# EAGLE design Proj15 (EAGLE 9.6.0)
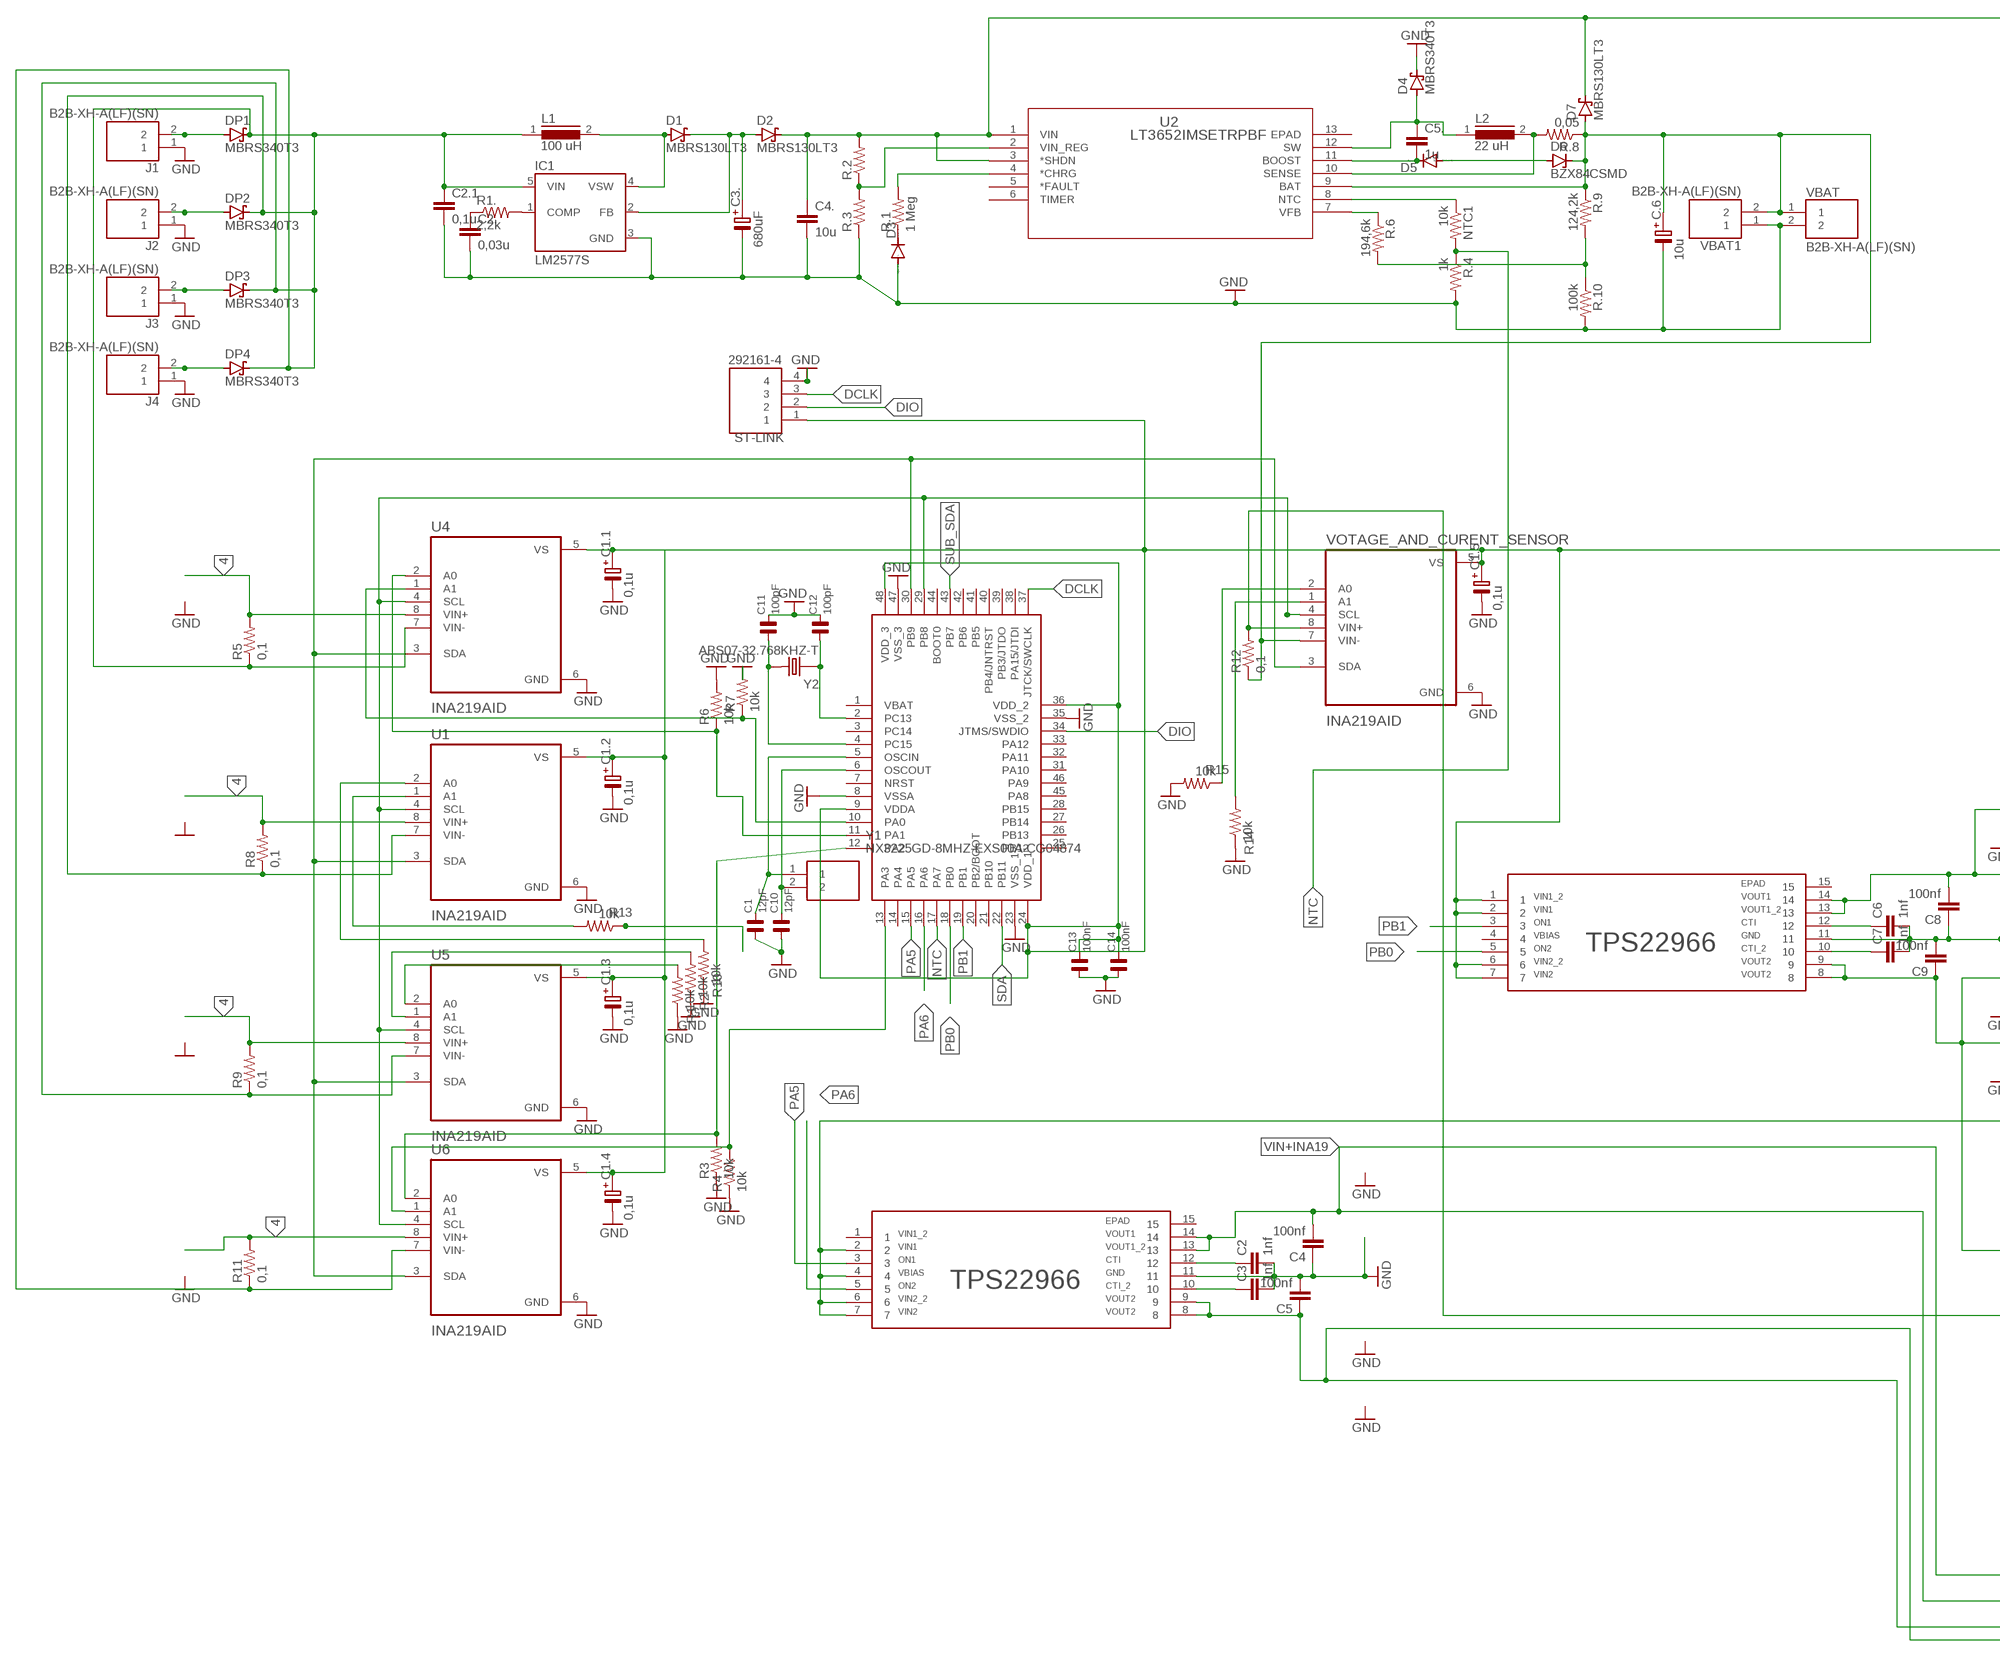
[diagram p0: schematic, sheet 1, part 1 of 2]
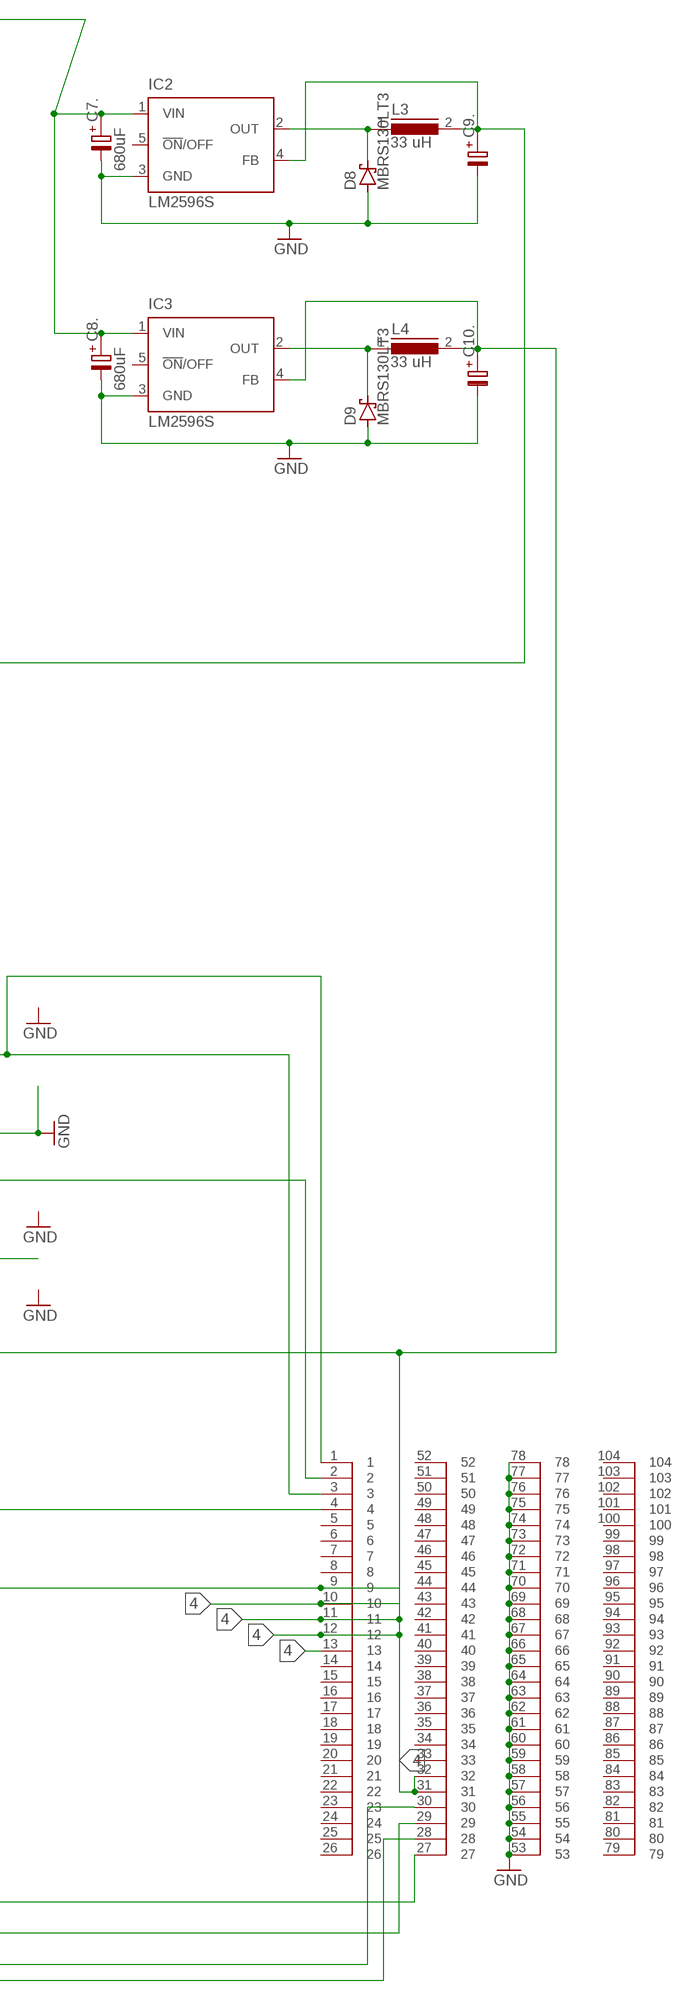
[diagram p1: schematic, sheet 1, part 2 of 2]

## Parts
C1  12pF  C0805  [0805]
C1.1  0,1u  C-PR-SMD-TE-D  [TE-D-7343]
C1.2  0,1u  C-PR-SMD-TE-D  [TE-D-7343]
C1.3  0,1u  C-PR-SMD-TE-D  [TE-D-7343]
C1.4  0,1u  C-PR-SMD-TE-D  [TE-D-7343]
C1.5  0,1u  C-PR-SMD-TE-D  [TE-D-7343]
C2  1nf  C-EUC0805  [C0805]
C2.  0,03u  C-EUC1206  [C1206]
C2.1  0,1u  C-EUC1206  [C1206]
C3  1nf  C-EUC0805  [C0805]
C3.  680uF  C-PR-SMD-TE-D  [TE-D-7343]
C4  100nf  C-EUC0805  [C0805]
C4.  10u  C-EUC1206  [C1206]
C5  100nf  C-EUC0805  [C0805]
C5.  1u  C-EUC1206  [C1206]
C6  1nf  C-EUC0805  [C0805]
C7  1nf  C-EUC0805  [C0805]
C7.  680uF  C-PR-SMD-TE-D  [TE-D-7343]
C8  100nf  C-EUC0805  [C0805]
C8.  680uF  C-PR-SMD-TE-D  [TE-D-7343]
C9  100nf  C-EUC0805  [C0805]
C9.  C-PR-SMD-TE-D  [TE-D-7343]
C10  12pF  C0805  [0805]
C10.  C-PR-SMD-TE-D  [TE-D-7343]
C11  100pF  C0805  [0805]
C12  100pF  C0805  [0805]
C13  100nF  C0805  [0805]
C14  100nF  C0805  [0805]
C.6  10u  C-PR-SMD-TE-D  [TE-D-7343]
D1  MBRS130LT3  [SMB]
D2  MBRS130LT3  [SMB]
D3  DIODE-DO214BA  [DO214BA]
D4  MBRS340T3  [SMC]
D5  DIODE-DO214BA  [DO214BA]
D6  BZX84CSMD  [TO236]
D7  MBRS130LT3  [SMB]
D8  MBRS130LT3  [SMB]
D9  MBRS130LT3  [SMB]
DP1  MBRS340T3  [SMC]
DP2  MBRS340T3  [SMC]
DP3  MBRS340T3  [SMC]
DP4  MBRS340T3  [SMC]
IC1  LM2577S  [TO263-5]
IC2  LM2596S  [TO263-5]
IC3  LM2596S  [TO263-5]
J1  B2B-XH-A(LF)(SN)  [JST_B2B-XH-A(LF)(SN)]
J2  B2B-XH-A(LF)(SN)  [JST_B2B-XH-A(LF)(SN)]
J3  B2B-XH-A(LF)(SN)  [JST_B2B-XH-A(LF)(SN)]
J4  B2B-XH-A(LF)(SN)  [JST_B2B-XH-A(LF)(SN)]
L1  100 uH  DR127  [DR127]
L2  22 uH  DR127  [DR127]
L3  33 uH  DR127  [DR127]
L4  33 uH  DR127  [DR127]
NTC1  10k  R-US_R0603  [R0603]
R1  10k  R-US_R3216  [R3216]
R1.  2,2k  R-US_R3216  [R3216]
R2  10k  R-US_R3216  [R3216]
R3  10k  R-US_R3216  [R3216]
R4  10k  R-US_R3216  [R3216]
R5  0,1  R-US_R3216  [R3216]
R6  10k  R-US_R3216  [R3216]
R7  10k  R-US_R3216  [R3216]
R8  0,1  R-US_R3216  [R3216]
R9  0,1  R-US_R3216  [R3216]
R10  10k  R-US_R3216  [R3216]
R11  0,1  R-US_R3216  [R3216]
R12  0,1  R-US_R3216  [R3216]
R13  10k  R-US_R3216  [R3216]
R14  10k  R-US_R3216  [R3216]
R15  10k  R-US_R3216  [R3216]
R.1  1 Meg  R-US_R3216  [R3216]
R.2  R-US_R3216  [R3216]
R.3  R-US_R3216  [R3216]
R.4  1k  R-US_R3216  [R3216]
R.6  194,6k  R-US_R3216  [R3216]
R.8  0,05  R-US_R3216  [R3216]
R.9  124,2k  R-US_R3216  [R3216]
R.10  100k  R-US_R3216  [R3216]
ST-LINK  292161-4  [TE_292161-4]
U1  INA219AID  [SOIC127P599X175-8N]
U2  LT3652IMSETRPBF  [MSOP-12_MSE]
U3  QFP50P900X900X160-48N  [QFP50P900X900X160-48N]
U4  INA219AID  [SOIC127P599X175-8N]
U5  INA219AID  [SOIC127P599X175-8N]
U6  INA219AID  [SOIC127P599X175-8N]
U$1  TPS22966  [SON40P300X200X80-15N]
U$2  TPS22966  [SON40P300X200X80-15N]
U$3  HEADERPIN4X26  [HEADERPIN4X26]
VBAT  B2B-XH-A(LF)(SN)  [JST_B2B-XH-A(LF)(SN)]
VBAT1  B2B-XH-A(LF)(SN)  [JST_B2B-XH-A(LF)(SN)]
VOTAGE_AND_CURENT_SENSOR  INA219AID  [SOIC127P599X175-8N]
Y1  NX3225GD-8MHZ-EXS00A-CG04874  [NX3225GD-STD-CRA-3]
Y2  ABS07-32.768KHZ-T  [XTAL_ABS07-32.768KHZ-T]

## Nets
4: C10..+ IC3.4(FB) L4.2 R5.2 R8.2 R9.2 R11.2 R12.2 U1.8(VIN+) U4.8(VIN+) U5.8(VIN+) U6.8(VIN+) U$1.2 U$1.4 U$1.6 U$1.7 U$3.9 U$3.10 U$3.11 U$3.12 U$3.13 U$3.31 U$3.32 VOTAGE_AND_CURENT_SENSOR.8(VIN+)
DCLK: ST-LINK.3 U3.37(JTCK/SWCLK)
DIO: ST-LINK.2 U3.34(JTMS/SWDIO)
GND: C1.1 C1.1.- C1.2.- C1.3.- C1.4.- C1.5.- C2.1.2 C2.2 C2..2 C3.2 C3..- C4.1 C4..2 C5.2 C6.2 C7.2 C7..- C8.1 C8..- C9.2 C9..- C10.1 C10..- C11.2 C12.2 C13.1 C14.1 C.6.- D3.A D4.C D8.A D9.A IC1.3(GND) IC2.3(GND) IC3.3(GND) J1.1 J2.1 J3.1 J4.1 R1.1 R2.1 R3.1 R4.1 R6.2 R7.2 R10.1 R14.1 R15.2 R.3.1 R.4.2 R.10.2 ST-LINK.4 U1.6(GND) U3.8(VSSA) U3.23(VSS_1) U3.35(VSS_2) U3.47(VSS_3) U4.6(GND) U5.6(GND) U6.6(GND) U$1.11 U$2.11 U$3.53 U$3.54 U$3.55 U$3.56 U$3.57 U$3.58 U$3.59 U$3.60 U$3.61 U$3.62 U$3.63 U$3.64 U$3.65 U$3.66 U$3.67 U$3.68 U$3.69 U$3.70 U$3.71 U$3.72 U$3.73 U$3.74 U$3.75 U$3.76 U$3.77 U$3.78 VBAT1.1 VBAT.2 VOTAGE_AND_CURENT_SENSOR.6(GND)
N$1: R10.2 U1.2(A0)
N$2: U1.4(SCL) U3.29(PB8) U4.4(SCL) U5.4(SCL) U6.4(SCL) VOTAGE_AND_CURENT_SENSOR.4(SCL)
N$3: R1.2 U5.2(A0)
N$4: R2.2 U5.1(A1)
N$7: R3.2 U3.12(PA2) U6.2(A0)
N$8: R4.2 U3.13(PA3) U6.1(A1)
N$11: R6.1 U3.11(PA1) U4.2(A0)
N$12: R7.1 U3.10(PA0) U4.1(A1)
N$14: C8.2 U$2.13 U$2.14 U$3.1 U$3.3
N$16: U1.3(SDA) U3.30(PB9) U4.3(SDA) U5.3(SDA) U6.3(SDA) VOTAGE_AND_CURENT_SENSOR.3(SDA)
N$18: R15.1 VOTAGE_AND_CURENT_SENSOR.2(A0)
N$20: C12.1 U3.2(PC13) Y2.1
N$21: C2.1 U$1.12
N$22: C3.1 U$1.10
N$23: C5.1 U$1.8 U$1.9 U$3.28 U$3.30
N$24: C10.2 U3.6(OSCOUT) Y1.2
N$25: C6.1 U$2.12
N$26: C7.1 U$2.10
N$27: C1.2 U3.5(OSCIN) Y1.1
N$28: C9.1 U$2.8 U$2.9 U$3.2 U$3.4
N$29: C11.1 U3.4(PC15) Y2.2
N$30: D8.C IC2.2(OUT) L3.1
N$31: DP2.A J2.2
N$32: DP3.A J3.2
N$33: DP4.A J4.2
N$34: DP1.A J1.2
N$36: D1.A IC1.4(VSW) L1.2
N$37: C3..+ D1.C D2.A IC1.2(FB)
N$38: IC1.1(COMP) R1..2
N$39: R13.2 U1.1(A1)
N$40: C2..1 R1..1
N$41: C4..1 C7..+ C8..+ D2.C D7.C IC2.1(VIN) IC3.1(VIN) R.2.2 U2.1(VIN) U2.3(*SHDN)
N$42: R.2.1 R.3.2 U2.2(VIN_REG)
N$43: D3.C R.1.1
N$44: R.1.2 U2.4(*CHRG)
N$45: R13.1
N$46: C5..2 D5.C U2.11(BOOST)
N$47: C5..1 D4.A L2.1 U2.12(SW)
N$48: L2.2 R.8.2 U2.10(SENSE)
N$49: R.6.1 U2.7(VFB)
N$50: D5.A D6.A
N$51: C.6.+ D6.C D7.A R12.1 R.8.1 R.9.1 U2.9(BAT) VBAT1.2 VBAT.1 VOTAGE_AND_CURENT_SENSOR.7(VIN-)
N$52: NTC1.1 U2.8(NTC)
N$54: R.6.2 R.9.2 R.10.1
N$55: C1.1.+ C1.2.+ C1.3.+ C1.4.+ C1.5.+ C9..+ C13.2 C14.2 IC2.4(FB) L3.2 ST-LINK.1 U1.5(VS) U3.9(VDDA) U3.24(VDD_1) U3.36(VDD_2) U3.48(VDD_3) U4.5(VS) U5.5(VS) U6.5(VS) U$2.1 U$2.2 U$2.6 U$2.7 VOTAGE_AND_CURENT_SENSOR.5(VS)
N$56: D9.C IC3.2(OUT) L4.1
N$58: C2.1.1 DP1.C DP2.C DP3.C DP4.C IC1.5(VIN) L1.1 R5.1 R8.1 R9.1 R11.1 U1.7(VIN-) U4.7(VIN-) U5.7(VIN-) U6.7(VIN-)
NTC: NTC1.2 R14.2 R.4.1 U3.17(PA7) VOTAGE_AND_CURENT_SENSOR.1(A1)
PA5: U3.15(PA5) U$1.3
PA6: U3.16(PA6) U$1.5
PB0: U3.18(PB0) U$2.5
PB1: U3.19(PB1) U$2.3
SDA: U3.22(PB11)
SUB_SDA: U3.43(PB7)
VIN+INA19: C4.2 U$1.13 U$1.14 U$3.27 U$3.29
Unconnected: IC2.5(!ON!/OFF) IC3.5(!ON!/OFF) U2.5(*FAULT) U2.6(TIMER) U2.13(EPAD) U3.1(VBAT) U3.3(PC14) U3.7(NRST) U3.14(PA4) U3.20(PB2/BOOT) U3.21(PB10) U3.25(PB12) U3.26(PB13) U3.27(PB14) U3.28(PB15) U3.31(PA10) U3.32(PA11) U3.33(PA12) U3.38(PA15/JTDI) U3.39(PB3/JTDO) U3.40(PB4/JNTRST) U3.41(PB5) U3.42(PB6) U3.44(BOOT0) U3.45(PA8) U3.46(PA9) U$1.1 U$1.15 U$2.4 U$2.15 U$3.5 U$3.6 U$3.7 U$3.8 U$3.14 U$3.15 U$3.16 U$3.17 U$3.18 U$3.19 U$3.20 U$3.21 U$3.22 U$3.23 U$3.24 U$3.25 U$3.26 U$3.33 U$3.34 U$3.35 U$3.36 U$3.37 U$3.38 U$3.39 U$3.40 U$3.41 U$3.42 U$3.43 U$3.44 U$3.45 U$3.46 U$3.47 U$3.48 U$3.49 U$3.50 U$3.51 U$3.52 U$3.79 U$3.80 U$3.81 U$3.82 U$3.83 U$3.84 U$3.85 U$3.86 U$3.87 U$3.88 U$3.89 U$3.90 U$3.91 U$3.92 U$3.93 U$3.94 U$3.95 U$3.96 U$3.97 U$3.98 U$3.99 U$3.100 U$3.101 U$3.102 U$3.103 U$3.104

## Library data of the parts
C1 C10-C14 = capsmd:C0805
C1.1-C1.5 C3. C7. C8. C9. C10. C.6 = cap-pan40:C-PR: POLARIZED ELECTROLYTIC/TANTALUM
C2 C2. C2.1 C3 C4 C4. C5 C5. C6-C9 = rcl:C-EU: CAPACITOR, European symbol; SPICEPREFIX: C
D1 D2 D7-D9 = diode:MBRS130LT3: Schottky Power Rectifier Source: http://www.onsemi.com/pub/Collateral/MBRS130LT3-D.PDF
D3 D5 = diode:DIODE-: DIODE
D4 DP1-DP4 = diode:MBRS3*0T3: SCHOTTKY BARRIER RECTIFIER 3.0 AMPERES 20, 30, 40 VOLT Source: MBRS340T3-D.pdf
D6 = diode:BZX84CSMD: Z DIODE
IC1 = v-reg-3:LM2577: National Semiconductor <http://www.national.com> 3.0A Step-Up "Simple Switcher"(c) 3.0A 65V NPN switch, step-up regulator
IC2 IC3 = national-semiconductor:LM2596: SIMPLE SWITCHER® Power Converter 150 kHz 3A Step-Down Voltage Regulator Source: http://www.national.com/ds/LM/LM2596.pdf; MF: NATIONAL SEMICONDUCTOR; MPN: LM2596S-ADJ/NOPB; OC_FARNELL: 9494367; OC_NEWARK: 41K3842
J1-J4 VBAT VBAT1 = B2B-XH-A_LF__SN_:B2B-XH-A(LF)(SN): XH Series 2 Position 2.5 mm Pitch Through Hole Top Entry Shrouded Header Check prices <https://pricing.snapeda.com/parts/B2B-XH-A%28LF%29%28SN%29/JST%20Sales/view-part?ref=eda>; AVAILABILITY: Good; DESCRIPTION: Connector Header Through Hole 2 position 0.098 (2.50mm); MF: JST Sales; MP: B2B-XH-A(LF)(SN); PACKAGE: None; PRICE: None; PURCHASE-URL: https://pricing.snapeda.com/search/part/B2B-XH-A(LF)(SN)/?ref=eda
L1-L4 = inductors:DR127: High Power Density, High Efficiency, Shielded Inductors Source: coiltronics_dr_series.pdf; SPICEPREFIX: L
NTC1 R1 R1. R2-R15 R.1-R.4 R.6 R.8-R.10 = rcl:R-US_: RESISTOR, American symbol; SPICEPREFIX: R
ST-LINK = 292161-4:292161-4: Check prices <https://pricing.snapeda.com/parts/292161-4/TE%20Connectivity/view-part?ref=eda>; AVAILABILITY: Good; COMMENT: 292161-4; DESCRIPTION: AMP CT Series, 2mm Pitch 4 Way 1 Row Straight PCB Header, Solder Termination, 2A; EU_ROHS_COMPLIANCE: Compliant; MF: TE Connectivity; MP: 292161-4; PACKAGE: None; PRICE: None; PURCHASE-URL: https://pricing.snapeda.com/search/part/292161-4/?ref=eda
U1 U4-U6 VOTAGE_AND_CURENT_SENSOR = INA219AID:INA219AID: Check prices <https://pricing.snapeda.com/parts/INA219AID/Texas%20Instruments/view-part?ref=eda>; AVAILABILITY: Warning; DESCRIPTION: 26V, 12-bit, i2c output current/voltage/power monitor 8-SOIC -40 to 125; MF: Texas Instruments; MP: INA219AID; PACKAGE: SOIC-8 Texas Instruments; PRICE: None; PURCHASE-URL: https://pricing.snapeda.com/search/part/INA219AID/?ref=eda
U2 = LT3652IMSETRPBF:LT3652IMSETRPBF: Check prices <https://pricing.snapeda.com/parts/LT3652IMSE%23TRPBF/Analog%20Devices/view-part?ref=eda>; AVAILABILITY: Warning; DESCRIPTION: Battery Charger Li-Ion 2000mA 4.2V Automotive 12-Pin MSOP EP T/R; MF: Analog Devices; MP: LT3652IMSE#TRPBF; PACKAGE: MSOP -12 Analog Devices; PRICE: None; PURCHASE-URL: https://pricing.snapeda.com/search/part/LT3652IMSE#TRPBF/?ref=eda
U3 = stm32:QFP50P900X900X160-48N; A1_MIN: 0.15; A_MAX: 1.6; B_MAX: 0.27; B_MIN: 0.17; B_NOM: 0.22; D1_MAX: 7.2; D1_MIN: 6.8; D1_NOM: 7.0; D2_NOM: 0.0; D_MAX: 9.2; D_MIN: 8.8; D_NOM: 9.0; E1_MAX: 7.2; E1_MIN: 6.8; E1_NOM: 7.0; E2_NOM: 0.0; ENOM: 0.5; E_MAX: 9.2; E_MIN: 8.8; E_NOM: 9.0; L_MAX: 0.75; L_MIN: 0.45; L_NOM: 0.6; MANUFACTURER: STMicroelectronics; PIN_COUNT_D: 12.0; PIN_COUNT_E: 12.0; SNAPEDA_PACKAGE_ID: 81294; STANDARD: IPC 7351B
U$1 U$2 = TPS22966:TPS22966
U$3 = Pin Header 4 x 26P:HEADERPIN4X26
Y1 = NX3225GD-8MHZ-EXS00A-CG04874:NX3225GD-8MHZ-EXS00A-CG04874: CRYSTAL 8MHZ 8PF SMD Source: Datasheet <https://www.ndk.com/images/products/catalog/c_NX3225GD-STD-CRA-3_e.pdf>; DESCRIPTION: CRYSTAL 8MHZ 8PF SMD; HEIGHT: mm; MANUFACTURER_NAME: NDK; MANUFACTURER_PART_NUMBER: NX3225GD-8MHZ-EXS00A-CG04874
Y2 = ABS07-32.768KHZ-T:ABS07-32.768KHZ-T: ABS07 Series 32.768 kHz ±20 ppm 12.5 pF -40 to +85 °C SMT Low Profile Crystal Check prices <https://pricing.snapeda.com/parts/ABS07-32.768KHZ-T/Abracon/view-part?ref=eda>; AVAILABILITY: Warning; DESCRIPTION: 32.768kHz ±20ppm Crystal 12.5pF 70 kOhms 2-SMD, No Lead; MF: Abracon; MP: ABS07-32.768KHZ-T; PACKAGE: SMD-2 Abracon LLC; PRICE: None; PURCHASE-URL: https://pricing.snapeda.com/search/part/ABS07-32.768KHZ-T/?ref=eda

## Board
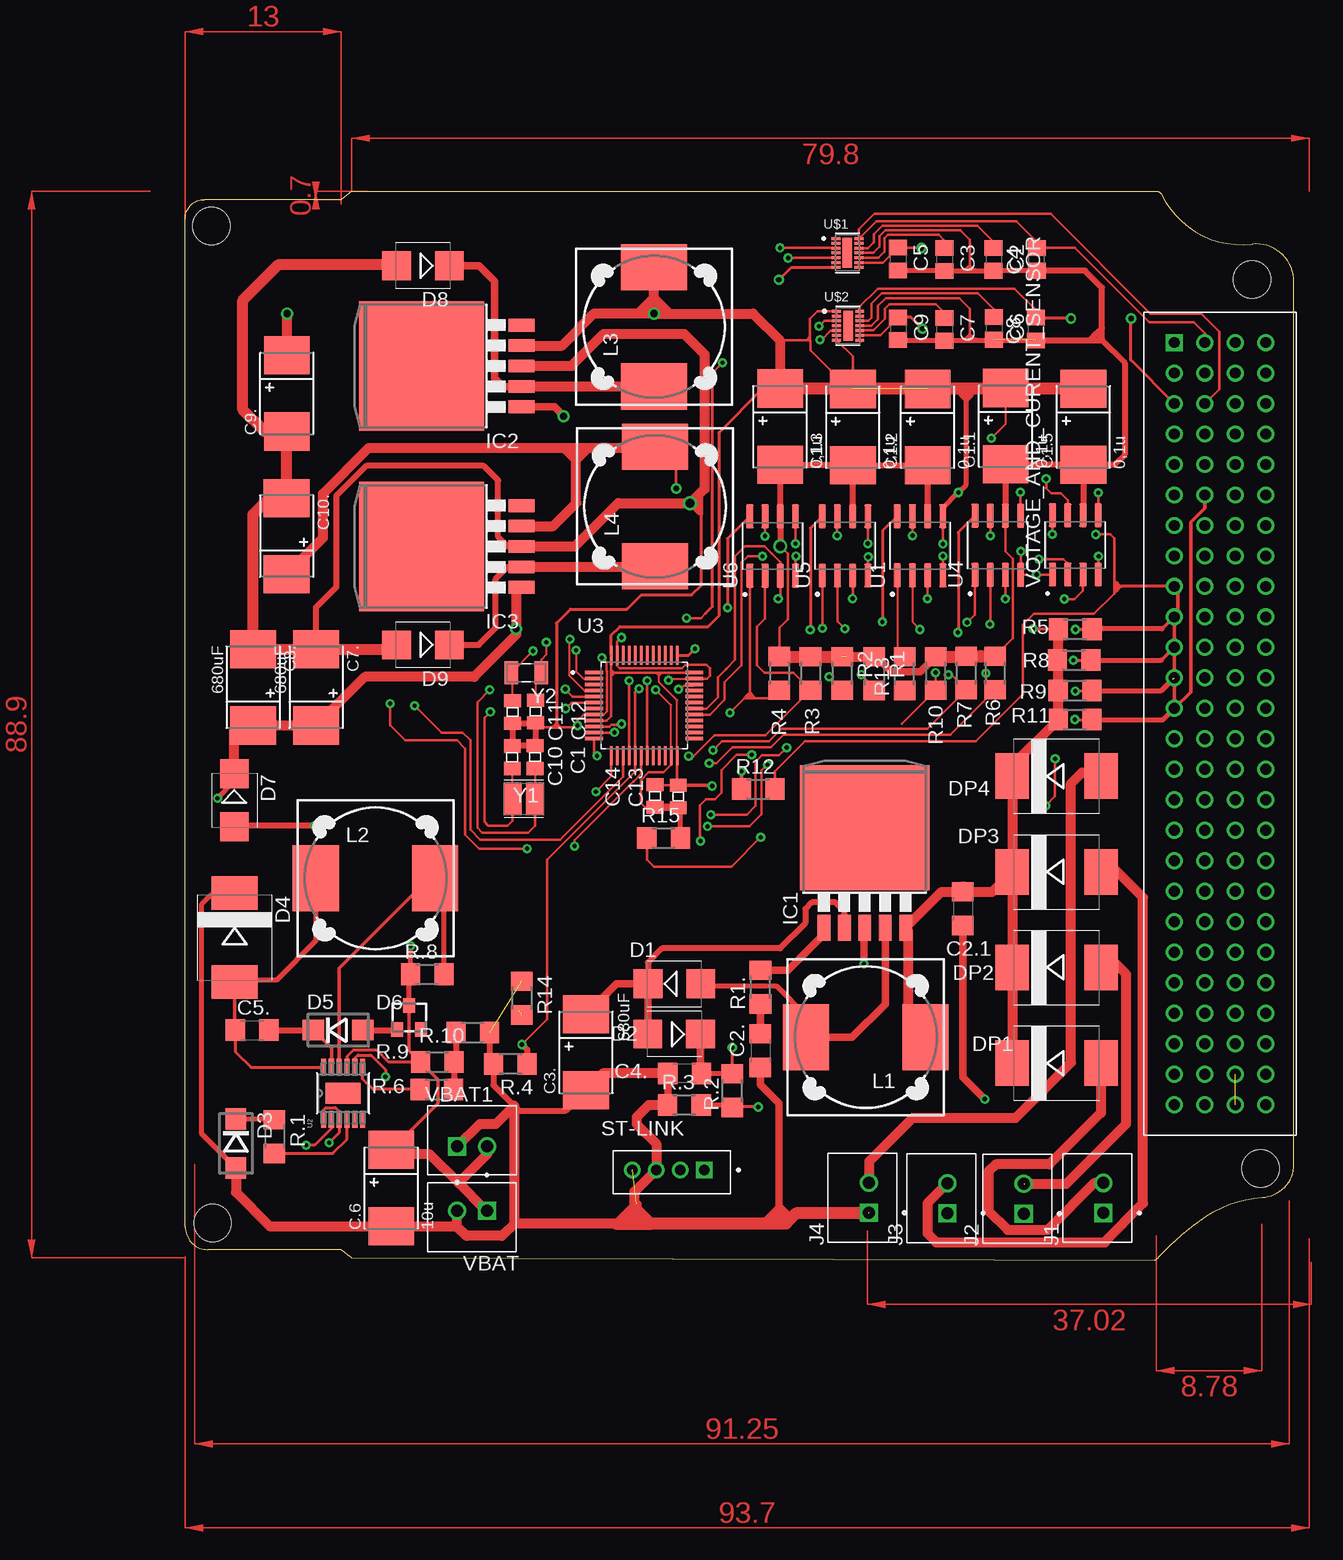
[diagram p2: board, top side]
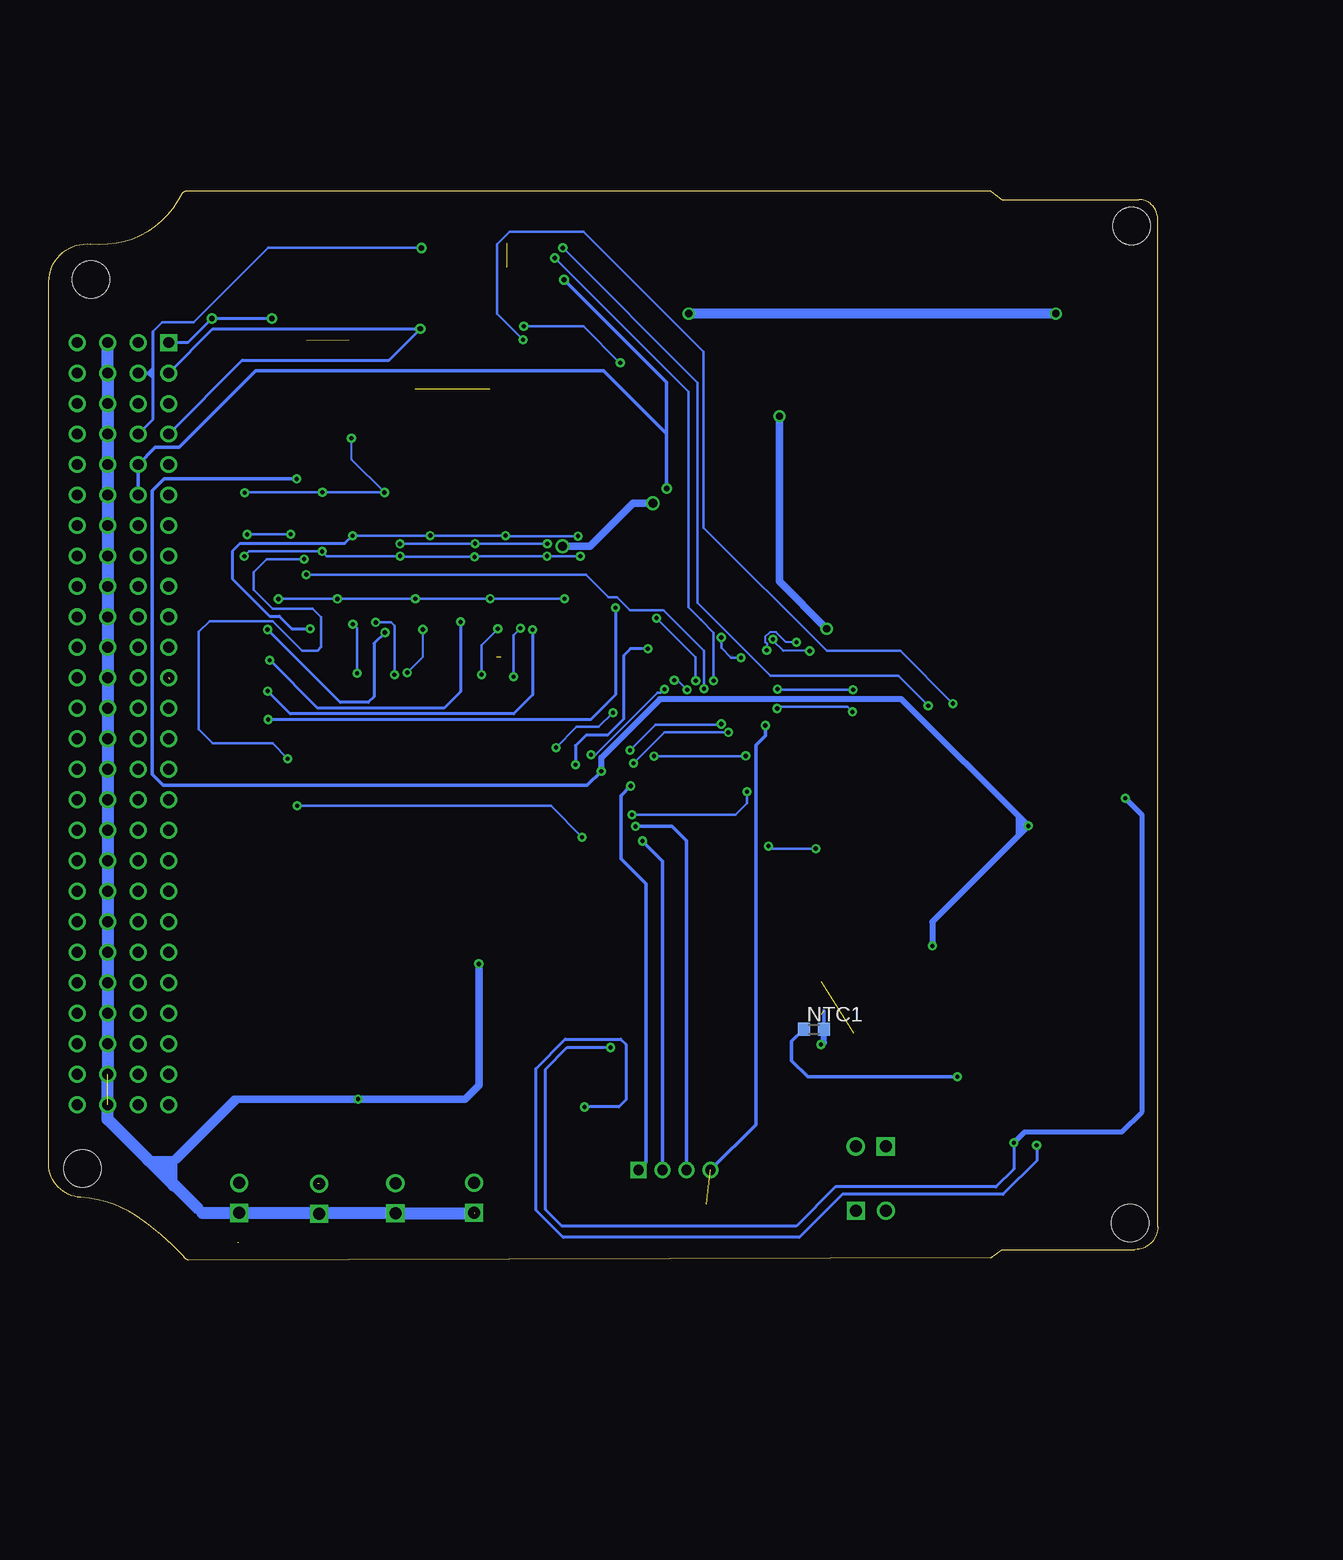
[diagram p3: board, bottom side, seen from below]

Size 92.44 x 89.07 mm. Coordinates in mm from the lower left corner, seen from the top.
Outline: 1.6,88.37 13,88.37 13.9,89.07 80.96,89.07 arc-64 81.39,88.8 arc71 88.95,84.66 arc-96 92.44,81.51 92.44,7.69 arc-80 89.8,5.22 arc31 85.18,3.68 arc13 81.21,0.3 arc-47 80.82,0 13.9,0.17 13,0.87 1.9,0.87 arc-90 0,2.77 0,86.77 arc-90 1.6,88.37
Outline: 1.5,88.37 1.6,88.37
Copper layers (1*16): Top 0.035mm / dielectric 1.5mm / Bottom 0.035mm
Design rules "default": minimum track width 6mil, minimum drill 0.35mm, track to track 6mil, track to pad 6mil, pad to pad 6mil, via to via 6mil, smd to smd 6mil, copper to edge 40mil, drill to drill 6mil, minimum pad ring 10mil, minimum via ring 8mil, stop-mask expansion 4mil, vias tented up to drill 0mil, thermal gap 10mil
Holes 3.1 mm at 2.2,86.17 2.3,3.07 89.65,7.64 88.94,81.7

### Footprints (pad centres in the part's own frame; a part is rotated, then mirrored left to right if it is on the bottom)
0805 = smd 1.092 x 1.397: 1 -0.94,0; 2 0.94,0
TE-D-7343 = smd 3.175 x 3.81: + 3.175,0; - -3.175,0
C0805 = smd 1.3 x 1.5: 1 -0.95,0; 2 0.95,0
C1206 = smd 1.6 x 1.8: 1 -1.4,0; 2 1.4,0
SMB = smd 2.4 x 2.4: A 2.2,0; C -2.2,0
DO214BA = smd 1.8 x 1.7: A 2.05,0; C -2.05,0
SMC = smd 2.8 x 3.8: A 3.7,0; C -3.7,0
TO236 = smd 1 x 1.2: A -1,-1; C 0,1; NC 1,-1
TO263-5 = smd 1.067 x 2.159: 1 -3.404,-5.791; 2 -1.702,-5.791; 3 0,-5.791; 4 1.702,-5.791; 5 3.404,-5.791 | smd 10.8 x 10.41: 6 0,2.54
JST_B2B-XH-A(LF)(SN) = drill 1 square: 1 -1.25,-0.525 | drill 1: 2 1.25,-0.525
DR127 = smd 3.85 x 5.5: 1 -4.975,0; 2 4.975,0
R0603 = smd 1 x 1.1: 1 -0.85,0; 2 0.85,0
R3216 = smd 1.6 x 1.8: 1 -1.4,0; 2 1.4,0
TE_292161-4 = drill 0.85 pad 1.2 square: 1 0,0 | drill 0.85 pad 1.2: 2 -2,0; 3 -4,0; 4 -6,0
SOIC127P599X175-8N = smd 1.97 x 0.6: 1 -2.47,1.905; 2 -2.47,0.635; 3 -2.47,-0.635; 4 -2.47,-1.905; 5 2.47,-1.905; 6 2.47,-0.635; 7 2.47,0.635; 8 2.47,1.905
MSOP-12_MSE = smd 1.397 x 0.432: 1 -2.184,1.626; 2 -2.184,0.975; 3 -2.184,0.325; 4 -2.184,-0.325; 5 -2.184,-0.975; 6 -2.184,-1.626; 7 2.184,-1.626; 8 2.184,-0.975; 9 2.184,-0.325; 10 2.184,0.325; 11 2.184,0.975; 12 2.184,1.626 | smd 1.753 x 2.946: 13 0,0
QFP50P900X900X160-48N = smd 1.56 x 0.28: 1 -4.18,2.75; 2 -4.18,2.25; 3 -4.18,1.75; 4 -4.18,1.25; 5 -4.18,0.75; 6 -4.18,0.25; 7 -4.18,-0.25; 8 -4.18,-0.75; 9 -4.18,-1.25; 10 -4.18,-1.75; 11 -4.18,-2.25; 12 -4.18,-2.75; 25 4.18,-2.75; 26 4.18,-2.25; 27 4.18,-1.75; 28 4.18,-1.25; 29 4.18,-0.75; 30 4.18,-0.25; 31 4.18,0.25; 32 4.18,0.75; 33 4.18,1.25; 34 4.18,1.75; 35 4.18,2.25; 36 4.18,2.75 | smd 0.28 x 1.56: 13 -2.75,-4.18; 14 -2.25,-4.18; 15 -1.75,-4.18; 16 -1.25,-4.18; 17 -0.75,-4.18; 18 -0.25,-4.18; 19 0.25,-4.18; 20 0.75,-4.18; 21 1.25,-4.18; 22 1.75,-4.18; 23 2.25,-4.18; 24 2.75,-4.18; 37 2.75,4.18; 38 2.25,4.18; 39 1.75,4.18; 40 1.25,4.18; 41 0.75,4.18; 42 0.25,4.18; 43 -0.25,4.18; 44 -0.75,4.18; 45 -1.25,4.18; 46 -1.75,4.18; 47 -2.25,4.18; 48 -2.75,4.18
SON40P300X200X80-15N = smd 0.8 x 0.23: 1 -0.965,1.2; 2 -0.965,0.8; 3 -0.965,0.4; 4 -0.965,0; 5 -0.965,-0.4; 6 -0.965,-0.8; 7 -0.965,-1.2; 8 0.965,-1.2; 9 0.965,-0.8; 10 0.965,-0.4; 11 0.965,0; 12 0.965,0.4; 13 0.965,0.8; 14 0.965,1.2 | smd 0.8 x 2.5: 15 0,0
HEADERPIN4X26 = drill 0.9 square: 1 0,0 | drill 0.9: 2 0,-2.54; 3 0,-5.08; 4 0,-7.62; 5 0,-10.16; 6 0,-12.7; 7 0,-15.24; 8 0,-17.78; 9 0,-20.32; 10 0,-22.86; 11 0,-25.4; 12 0,-27.94; 13 0,-30.48; 14 0,-33.02; 15 0,-35.56; 16 0,-38.1; 17 0,-40.64; 18 0,-43.18; 19 0,-45.72; 20 0,-48.26; 21 0,-50.8; 22 0,-53.34; 23 0,-55.88; 24 0,-58.42; 25 0,-60.96; 26 0,-63.5; 27 2.54,0; 28 2.54,-2.54; 29 2.54,-5.08; 30 2.54,-7.62; 31 2.54,-10.16; 32 2.54,-12.7; 33 2.54,-15.24; 34 2.54,-17.78; 35 2.54,-20.32; 36 2.54,-22.86; 37 2.54,-25.4; 38 2.54,-27.94; 39 2.54,-30.48; 40 2.54,-33.02; 41 2.54,-35.56; 42 2.54,-38.1; 43 2.54,-40.64; 44 2.54,-43.18; 45 2.54,-45.72; 46 2.54,-48.26; 47 2.54,-50.8; 48 2.54,-53.34; 49 2.54,-55.88; 50 2.54,-58.42; 51 2.54,-60.96; 52 2.54,-63.5; 53 5.08,-2.54; 54 5.08,-5.08; 55 5.08,-7.62; 56 5.08,-10.16; 57 5.08,-12.7; 58 5.08,-15.24; 59 5.08,-17.78; 60 5.08,-20.32; 61 5.08,-22.86; 62 5.08,-25.4; 63 5.08,-27.94; 64 5.08,-30.48; 65 5.08,-33.02; 66 5.08,-35.56; 67 5.08,-38.1; 68 5.08,-40.64; 69 5.08,-43.18; 70 5.08,-45.72; 71 5.08,-48.26; 72 5.08,-50.8; 73 5.08,-53.34; 74 5.08,-55.88; 75 5.08,-58.42; 76 5.08,-60.96; 77 5.08,-63.5; 78 5.08,0; 79 7.62,-2.54; 80 7.62,-5.08; 81 7.62,-7.62; 82 7.62,-10.16; 83 7.62,-12.7; 84 7.62,-15.24; 85 7.62,-17.78; 86 7.62,-20.32; 87 7.62,-22.86; 88 7.62,-25.4; 89 7.62,-27.94; 90 7.62,-30.48; 91 7.62,-33.02; 92 7.62,-35.56; 93 7.62,-38.1; 94 7.62,-40.64; 95 7.62,-43.18; 96 7.62,-45.72; 97 7.62,-48.26; 98 7.62,-50.8; 99 7.62,-53.34; 100 7.62,-55.88; 101 7.62,-58.42; 102 7.62,-60.96; 103 7.62,-63.5; 104 7.62,0
NX3225GD-STD-CRA-3 = smd 1.5 x 2.7: 1 -0.95,0; 2 0.95,0
XTAL_ABS07-32.768KHZ-T = smd 1.1 x 1.9: 1 -1.25,0; 2 1.25,0

### Placement (x,y rotation side)
C1  29.17,41.9 270 top
C1.1  68.4,69.49 90 top
C1.2  61.9,69.41 90 top
C1.3  55.67,69.41 90 top
C1.4  49.6,69.45 90 top
C1.5  74.88,69.43 90 top
C2  67.4,83.39 270 top
C2.  47.95,17.45 270 top
C2.1  64.83,29.28 270 top
C3  63.31,83.37 270 top
C3.  33.43,17.31 90 top
C4  70.99,83.39 90 top
C4.  41.64,15.54 180 top
C5  59.41,83.41 270 top
C5.  5.59,19.15 0 top
C6  67.42,77.64 270 top
C7  63.31,77.55 270 top
C7.  10.92,47.72 270 top
C8  70.94,77.58 90 top
C8.  5.67,47.72 270 top
C9  59.44,77.6 270 top
C9.  8.49,72.22 90 top
C10  27.27,41.9 270 top
C10.  8.46,60.32 270 top
C11  27.31,45.66 270 top
C12  29.22,45.72 270 top
C13  41.11,38.63 90 top
C14  39.18,38.67 90 top
C.6  17.2,6 90 top
D1  40.79,23.01 0 top
D2  40.77,18.83 180 top
D3  4.24,9.71 270 top
D4  4.13,26.87 270 top
D5  12.76,19.15 0 top
D6  18.69,20.2 0 top
D7  4.11,38.31 270 top
D8  19.82,82.86 180 top
D9  19.82,51.25 180 top
DP1  72.66,16.4 0 top
DP2  72.66,24.38 0 top
DP3  72.66,32.35 0 top
DP4  72.66,40.32 0 top
IC1  56.66,33.48 0 top
IC2  22.25,74.5 90 top
IC3  22.25,59.46 90 top
J1  76.04,5.17 90 top
J2  69.38,5.11 90 top
J3  63.03,5.15 90 top
J4  56.47,5.18 90 top
L1  56.74,18.58 180 top
L2  15.87,31.81 0 top
L3  39.09,77.76 90 top
L4  39.18,62.79 90 top
NTC1  28.66,19.23 0 bottom
R1  57.44,48.86 270 top
R1.  47.97,22.74 90 top
R2  54.77,48.88 270 top
R3  52.13,48.88 270 top
R4  49.54,48.89 270 top
R5  74.21,52.56 0 top
R6  67.54,48.92 90 top
R7  65.12,48.92 90 top
R8  74.11,49.99 0 top
R9  74.18,47.45 0 top
R10  62.56,48.88 270 top
R11  74.19,45.04 0 top
R12  47.78,39.24 0 top
R13  59.97,48.87 90 top
R14  28.07,21.82 270 top
R15  39.89,35.18 0 top
R.1  7.46,10.28 270 top
R.2  45.61,14.12 90 top
R.3  41.62,12.93 0 top
R.4  27.11,16.33 180 top
R.6  20.99,14.21 0 top
R.8  20.19,23.81 0 top
R.9  21.03,16.5 0 top
R.10  23.99,18.95 0 top
ST-LINK  43.28,7.51 0 top
U1  61.27,59.52 90 top
U2  13.17,13.9 90 top
U3  38.26,46.21 0 top
U4  67.75,59.56 90 top
U5  55.02,59.51 90 top
U6  48.98,59.5 90 top
U$1  55.21,83.92 0 top
U$2  55.27,77.86 0 top
U$3  82.46,76.45 0 top
VBAT  23.91,3.58 180 top
VBAT1  23.93,9.99 0 top
VOTAGE_AND_CURENT_SENSOR  74.21,59.59 90 top
Y1  28.24,38.43 180 top
Y2  28.45,48.94 180 top

### Tracks (layer width: path | path; a pad name or v marks a point on that pad's centre or on a via)
4  (via drill 0.35, 0.45)  (4 unrouted)
  Top 0.152: U$3.13
  Top 0.2: 77.7,55.77 78.06,56.13 77.99,56.13 | 77.7,55.77 77.46,55.53 | 77.99,56.13 77.7,56.42 | 77.7,56.42 77.62,56.5 | 77.62,56.5 77.46,56.66 | 77.99,56.13 77.83,56.13 | 77.83,56.13 77.48,56.13 77.46,56.11 | 77.7,56.42 77.7,56 | 77.7,56 77.7,55.89 | 77.7,55.89 77.7,55.77 | 77.62,56.5 77.62,55.97 77.7,55.89 | 77.7,55.89 77.62,55.81 77.46,55.81 | 77.7,56 77.83,56.13
  Top 0.203: L4.2 40.94,66.01 v40.94,64.3 | R12.2 49.18,40.73 51.67,43.22 65.93,43.22 69.84,47.14 69.84,52.94 70.74,53.84 75.77,53.84 77.46,55.53 77.46,55.81 77.46,56.11 77.46,56.66 77.46,60.15 77.15,60.46 v75.91,60.46 | v72.3,60.47 VOTAGE_AND_CURENT_SENSOR.8
  Top 0.254: U6.8 45.21,60.11 v45.21,54.36 | v74.17,45.04 R11.2 | v49.5,81.69 50.53,82.72 U$1.7 | U$3.9 78.06,56.13 | U4.8 64.45,60.64 64.45,52.31 v64.43,52.29 | v74.22,52.54 74.24,52.56 R5.2 | U5.8 52.13,61 52.13,52.54 v52.11,52.52 | v74.21,47.41 74.25,47.45 R9.2 | U1.8 58.15,60.78 58.15,53.19 v58.13,53.17 | v74.04,49.97 74.06,49.99 R8.2
  Top 0.305: U$3.13 83.82,47.33 83.82,61.48 85,62.65 U$3.32 | U$3.10 82.76,53.89 82.76,55.84 U$3.9 | 81.46,52.6 U$3.10 | U$3.11 U$3.10 | 81.4,49.99 U$3.11 | U$3.13 U$3.12 U$3.11
  Top 0.406: R11.2 81.53,45.04 U$3.13 | 81.46,52.6 75.64,52.6 R5.2 | R9.2 81.4,47.45 82.33,48.38 | R8.2 81.4,49.99
  Top 0.813: C10..+ 11.5,60.19 11.5,63.87 15.3,67.67 31.6,67.67 | L4.2 39.18,68.05 39.4,68.27 39.5,68.17 39.5,67.67 33.6,67.67 | 31.6,67.67 33.6,67.67 | IC3.4 30.69,61.16 32.6,63.07 32.6,66.67 | 32.6,66.67 31.6,67.67 | 32.6,66.67 33.6,67.67
  Bottom 0.152: 76.19,73.09 76.19,73.11 | 40.97,68.16 40.96,68.16
  Bottom 0.203: v75.91,60.46 v72.31,60.46 v72.3,60.47
  Bottom 0.254: v45.21,54.36 45.21,47.11 47.27,45.04 v74.17,45.04 | v64.43,52.29 65.33,51.39 65.33,46.95 65.82,46.46 68.16,46.46 74.22,52.52 v74.22,52.54 | v52.11,52.52 52.11,47.1 53.69,45.52 72.32,45.52 v74.21,47.41 | v58.13,53.17 58.13,47.36 59.51,45.98 70.02,45.98 74.01,49.97 v74.04,49.97
  Bottom 0.305: 40.97,68.16 40.97,64.33 v40.94,64.3 | 40.96,68.84 40.96,73.16 v49.5,81.69 | U$3.32 U$3.31 83.57,67.72 81.56,67.72 76.19,73.09 | 76.19,73.11 75.2,74.1 46.22,74.1 40.96,68.84 | 40.96,68.16 40.96,68.84
DCLK  (via drill 0.35)
  Top 0.203: v48.54,41.28 48.06,40.8 48.06,37.14 47.05,36.13 v43.54,36.13
  Top 0.254: U3.37 41.95,50.39 v42.51,50.94
  Bottom 0.254: v42.51,50.94 43.96,50.94 44.54,50.37 44.54,45.07 45.86,43.74 47.66,43.74 48.54,42.86 v48.54,41.28
  Bottom 0.305: ST-LINK.3 39.28,30.48 39.28,30.84 | 39.28,30.84 39.29,30.85 | 39.28,30.84 39.28,34.92 40.52,36.16 43.52,36.16 v43.54,36.13
DIO  (via drill 0.35)
  Top 0.2: U3.34 42.33,47.85 41.58,47.85 41.3,47.57 v41.13,47.57 | v47.24,42.09 45.98,42.09 44.71,40.82 44.71,38.93 44.17,38.39 43.41,38.39 42.91,37.89 42.91,34.96 v42.95,34.92
  Bottom 0.2: v41.13,47.57 41.45,47.25 41.72,47.25 46.88,42.09 v47.24,42.09
  Bottom 0.305: ST-LINK.2 41.28,28.45 | 41.27,28.46 41.28,28.45 | 41.28,28.45 41.28,33.25 v42.95,34.92
GND  (via drill 0.35, 0.75)  (6 unrouted)
  Top 0.152: 22.65,2.83 22.66,2.84 | 27.45,12.84 27.42,12.87 | 27.48,3 27.45,3.04 | C10.1 27.27,42.95 27.27,44.69 | 27.27,44.69 C11.2 | 29.22,42.96 29.22,42.89 C1.1 | 30.82,44.4 29.59,44.4 | 29.52,44.47 C12.2 29.13,44.69 27.27,44.69 | U3.23 40.51,46.25 v39.23,47.53 | v40.31,48.33 40.44,48.46 U3.35
  Top 0.2: 63.23,76.97 63.23,76.68 C7.2 | U$2.11 57.2,77.86 57.76,78.42 57.76,79.5 58.42,80.16 62.71,80.16 | R6.2 69.02,51.8 69.02,58.44 68.38,59.08 U4.6 | R4.1 49.54,52.7 50.25,53.41 50.25,58.84 v49.61,59.47 | U3.8 33.2,45.46 32.72,44.98 v32.72,44.54 32.58,44.4 31.29,44.4 29.59,44.4 29.52,44.47
  Top 0.203: 63.23,76.97 63.54,76.66 63.54,76.65 | U$1.11 57.37,83.92 57.88,84.43 57.88,85.32 58.37,85.81 64.63,85.81 65.43,85.01 65.43,82.94 | 63.22,82.75 63.15,82.82 63.03,82.7 | 63.22,82.75 63.53,82.44 63.54,82.43 | 63.03,82.7 62.76,82.43 62.75,82.42 | 63.22,82.75 63.18,82.7 63.03,82.7 | 43.03,62.14 43.03,62.45 | 43.03,62.45 43.03,62.59 | 43.03,62.59 43.03,62.72 | 43.03,62.72 43.03,62.82 | 43.03,63.34 43.03,63.03 | 43.03,63.34 43.03,63.87 | 43.03,63.34 42.86,63.18 | 42.86,63.18 42.8,63.11 | 42.8,63.11 42.45,62.76 42.41,62.76 | 42.98,62.77 43.03,62.72 | 42.25,62.92 42.58,62.59 43.02,62.59 43.03,62.59 | 42.79,62.38 v42.1,63.07 42.4,62.77 42.98,62.77 | 43.03,62.45 42.96,62.38 42.79,62.38 | 42.79,62.38 42.8,62.39 42.8,62.96 | 42.8,62.96 42.8,63.11 | 43.03,63.03 43.03,62.82 | 43.03,62.82 42.98,62.77 | 43.03,63.03 42.96,62.96 42.8,62.96 | 43.03,63.03 43.01,63.03 42.86,63.18 | 62.71,80.16 64.54,80.16 65.44,79.26 65.44,77.21 | 65.44,77.21 65.36,77.14 | 65.36,77.14 65.17,76.95 | 65.17,76.95 64.88,76.65 | 65.44,77.21 65.44,77.17 65.67,76.94 | 65.67,76.94 65.96,76.65 | 65.36,77.14 65.43,77.07 65.43,76.65 | 65.67,76.94 65.18,76.94 65.17,76.95 | 65.43,82.94 65.22,82.73 | 65.22,82.73 64.93,82.44 | 65.43,82.94 65.43,82.9 | 65.43,82.9 65.89,82.44 | 65.43,82.9 65.43,82.72 | 65.43,82.72 65.43,82.5 65.37,82.44 | 65.43,82.72 65.23,82.72 65.22,82.73 | U3.35 43.51,48.46 43.74,48.69 43.74,49.32 43.47,49.6 41.73,49.6 41.44,49.31 36.23,49.31 36.01,49.53 U3.47 36.01,51.5 v36.39,51.88 | U3.23 40.53,42.01 40.53,41.28 39.88,40.63 38.64,40.63 38.01,40 38.01,38.07 38.35,37.73 40.04,37.73 | 40.04,37.73 | U3.8 34.87,45.46 35.16,45.75 35.16,49.08 35.12,49.12 35.12,49.82 v34.74,50.2
  Top 0.254: v42.1,63.07 42.25,62.92 42.41,62.76 42.58,62.59 42.79,62.38 42.94,62.23 43.03,62.14 | 43.03,62.14 43.03,56.23 42.23,55.43 38.04,55.43 36.82,54.21 36.79,54.24 32.13,54.24 30.96,53.07 30.96,44.73 | 30.96,44.73 31.29,44.4 31.01,44.4 | 42.97,63.94 43.03,63.87 43.03,62.14 | 31.01,44.4 30.82,44.4 30.63,44.4 30.87,44.64 | 30.96,44.73 30.87,44.64 | 31.01,44.4 30.87,44.54 30.87,44.64
  Top 0.406: D3.A 1.4,10.5 1.4,29.67 2.5,30.77 3.93,30.77 D4.C | 49.59,50.63 49.59,50.35 R4.1 | 66.54,50.32 66.33,50.32 | C8.1 70.92,76.65 65.96,76.65 65.43,76.65 64.88,76.65 63.54,76.65 C9.2 | C6.2 | C5.2 63.27,82.46 C3.2 62.75,82.42 | 62.76,82.43 63.54,82.43 | 63.53,82.44 64.93,82.44 65.37,82.44 65.89,82.44 C2.2 C4.1 | v42.1,63.07 42.94,62.23 | R15.2 41.29,37.69 C13.1
  Top 0.508: C3..- 31.74,12.45 27.84,12.45 27.42,12.87 25.71,14.58 R.4.2 25.39,16.65 R.10.2 | IC3.3 26.91,59.46 26.1,60.27 26.1,64.97 24.9,66.17 15.1,66.17 12.6,63.67 12.6,56.07 10.9,54.37 10.9,50.92 C7..- | v49.61,59.47 U6.6 49.61,66.26 C1.4.- 55.63,66.28 C1.3.- | U5.6 55.66,66.22 C1.3.- | 49.61,50.65 49.59,50.63 | C1.2.- 61.9,66.17 | 61.9,66.17 U1.6 | U4.6 68.4,62.05 C1.1.- 74.82,66.32 C1.5.- | C1.5.- 74.88,62.1 VOTAGE_AND_CURENT_SENSOR.6 | C1.3.- 61.83,66.24 61.9,66.17 | C8.1 75.4,76.63 75.43,76.66 | 75.43,76.66 76.43,76.66 | 76.43,76.66 78.33,74.76 78.33,67.11 77.47,66.25 C1.5.- | 76.43,76.77 76.43,77.66 | 76.43,77.66 76.43,81.03 75.02,82.44 C4.1 | 76.43,77.66 75.98,77.22 | 75.98,77.22 75.43,76.66 | 75.98,77.22 76.24,76.96 | 76.24,76.96 76.43,76.77 | 76.43,76.77 76.43,76.66 | 76.43,76.66 76.24,76.85 76.24,76.96 | 29.13,44.69 29.1,44.72 C11.2 27.31,42.98 27.27,42.95 | C12.2 29.22,42.96 | C10.1 27.33,42.89 29.22,42.89
  Top 0.61: C2.1.2 64.83,15.24 v66.66,13.41 | v56.6,24.67 56.6,27.63 IC1.3 | C2..2 47.95,14.62 49.5,13.07 49.5,4.47 | 49.54,4.16 49.68,4.3 50.3,3.67 49.5,3.67 | 49.5,4.47 49.65,4.32 49.5,4.17 49.5,3.67 | 49.5,4.47 49.5,4.36 48.91,3.77 | 48.91,3.77 48.2,3.06 | 49.5,3.67 49.5,3.06 | 50.1,3.06 49.61,3.06 48.91,3.77 | C4..2 40.24,12.95 R.3.1 | 40.09,3.15 40,3.06 | 38.9,3.06 38.85,3 | C14.1 40.04,37.73 41.07,37.73 C13.1 | R1.1 57.63,50.26 58.88,49.01 61.28,49.01 R10.1
  Top 0.813: D3.A 4.24,5.63 7.04,2.83 C.6.- 22.65,2.83 23.47,2.01 26.42,2.01 27.45,3.04 27.45,12.84 | 7.3,63.77 8.18,63.77 C10..- | IC2.3 32.23,74.5 34.9,77.17 41.6,77.17 43.3,75.47 43.3,64.27 42.97,63.94 v42.1,63.07 36.1,63.07 32.49,59.46 IC3.3 | 37.64,4.64 37.25,4.26 | 37.25,4.26 36,3 27.48,3 | 37.64,4.32 38.9,3.06 | 37.25,4.26 37.46,4.04 | 37.46,3 37.46,4.04 | R.3.1 38.66,12.93 37.64,11.91 37.64,11.33 39.28,9.68 39.28,7.52 37.46,5.7 37.46,4.04 | 22.66,2.84 VBAT.2 | VBAT1.1 24.55,11.33 25.88,11.33 27.42,12.87 | R2.1 57.42,50.28 R1.1
  Top 0.85: C3..- 34.83,15.54 C4..2
  Top 0.9: C10..- 8.46,68.21 8.2,68.47 8.49,68.76 C9..- 6.62,69.05 4.8,70.87 4.8,79.97 7.8,82.97 17.51,82.97 D8.A | 7.3,63.77 5.67,62.14 C8..- C7..- 17.27,50.9 D9.A
  Top 1: 36,3 37.46,3 38.85,3 | 38.9,3.06 40,3.06 48.2,3.06 49.5,3.06 50.1,3.06 50.93,3.89 56.97,3.89
  Top 1.016: R4.1 R3.1 55.13,50.28 | R10.1 65.08,50.28 R7.2 66.33,50.32 R6.2
  Bottom 0.152: 80.06,4.35 79.64,3.92 | J2.1 69.87,3.9 J3.1 | 76.55,3.91 J1.1 | 70.1,3.9 70.11,3.91 | 57.02,3.9 J4.1 | 33.51,42.89 33.5,42.89 | 87.54,14.93 U$3.76 | v39.23,47.53 40.02,48.33 v40.31,48.33
  Bottom 0.203: v34.74,50.2 35.58,50.2 36.39,51 v36.39,51.88
  Bottom 0.305: v32.71,44.53 32.71,43.67 33.5,42.89 33.5,11.29 ST-LINK.4
  Bottom 0.508: v32.72,44.54 v32.71,44.53
  Bottom 0.61: v56.6,24.67 56.6,14.57 57.76,13.41 v66.66,13.41 76.7,13.41 | v42.1,63.07 43.75,63.07 47.33,59.5 49.59,59.5 v49.61,59.47 | 82.05,6.23 82.05,6.33 82.05,8.37 | 76.7,13.41 77,13.41 82.05,8.37 | 82.05,8.37 82.43,8.37 | 82.43,8.37 82.98,8.37 | 82.98,8.37 84.15,8.37 84.17,8.35 | 82.43,8.37 82.43,7.82 | 82.89,7.07 82.43,7.54 82.43,7.82 | 82.43,7.82 82.63,8.02 | 82.63,8.02 82.98,8.37 | 83.58,7.76 82.89,7.76 82.63,8.02 | 76.7,13.41 81.75,8.37
  Bottom 1: 79.64,3.92 J1.1 | 70.11,3.91 76.55,3.91 | 70.1,3.9 J3.1 57.02,3.9
  Bottom 1.016: 82.05,6.33 80.06,4.35 | 82.05,6.23 82.89,7.07 83.58,7.76 84.17,8.35 87.54,11.72 87.54,14.93 | U$3.78 U$3.53 U$3.54 U$3.55 U$3.56 U$3.57 U$3.58 U$3.59 U$3.60 U$3.61 U$3.62 U$3.63 U$3.64 U$3.65 U$3.66 U$3.67 U$3.68 U$3.69 U$3.70 U$3.71 U$3.72 U$3.73 U$3.74 U$3.75 U$3.76
N$1  (via drill 0.35)
  Top 0.152: U1.2 60.63,53.18 v61.27,52.54 | v62.56,48.95 R10.2
  Top 0.203: 59.76,44.68 R10.2
  Bottom 0.152: v61.27,52.54 61.27,50.25 v62.56,48.95
N$2  (via drill 0.35)
  Top 0.2: U4.4 69.66,57.21 | 69.66,57.21 69.66,59.03 v69.67,59.05 69.67,57.23 69.66,57.21 | v48.14,58.64 46.91,58.64 46.4,58.13 46.4,49.58 44.96,48.14 44.96,46.68 43.74,45.46 U3.29
  Top 0.203: U6.4 50.88,58.63 v50.92,58.66 | v56.95,58.59 56.92,58.57 U5.4 | v63.17,58.66 U1.4 | 70.17,57.09 U4.4 | v76.15,58.65 76.15,57.16 VOTAGE_AND_CURENT_SENSOR.4
  Bottom 0.2: v48.14,58.64 50.9,58.64 v50.92,58.66
  Bottom 0.203: v76.15,58.65 75.75,59.05 v69.67,59.05 69.28,58.66 v63.17,58.66 63.12,58.61 | 63.09,58.58 63.12,58.61 | v50.92,58.66 56.95,58.66 v56.95,58.59 56.97,58.61 63.12,58.61
N$3  (via drill 0.35)
  Top 0.203: U5.2 54.38,53.24 v55.01,52.61 | v56.38,48.79 57.44,47.73 R1.2
  Bottom 0.203: v55.01,52.61 56.38,51.24 v56.38,48.79
N$4  (via drill 0.35)
  Top 0.203: U5.1 53.11,52.66 v53.13,52.64 | v53.69,48.61 54.77,47.54 R2.2
  Bottom 0.203: v53.13,52.64 53.69,52.08 v53.69,48.61
N$7  (via drill 0.35)
  Top 0.2: R3.2 48.39,43.74 44.12,43.74 42.38,42 v41.99,42 | v34.35,42.01 34.08,42.28 U3.12
  Top 0.203: R3.2 50.69,48.92 48.31,48.92 47.68,49.55 47.68,52.75 48.35,53.42 U6.2
  Bottom 0.2: v41.99,42 34.36,42 v34.35,42.01
N$8  (via drill 0.35)
  Top 0.203: U6.1 47.08,47.3 | 47.56,46.82 47.36,47.02 | 47.36,47.02 47.08,47.3 | 47.56,46.82 49.79,46.82 49.79,47.24 R4.2 | 47.56,46.82 47.15,46.82 | 47.15,46.82 46.62,46.82 | 46.62,46.82 v45.42,45.61 | 47.08,47.3 47.08,47.27 | 46.62,46.82 46.86,47.05 | 46.86,47.05 47.08,47.27 | 47.08,47.27 47.15,47.2 47.15,46.82 | 47.36,47.02 46.88,47.02 46.86,47.05 | v50.16,42.71 49.52,42.07 48.11,42.07 47.54,41.51 47.54,37.84 46.83,37.12 43.85,37.12 v43.83,37.1 | v34.24,39.02 35.51,40.3 U3.13
  Bottom 0.203: v50.16,42.71 48.44,44.42 46.61,44.42 v45.42,45.61 | v43.83,37.1 43.81,37.11 35.21,37.11 34.24,38.08 v34.24,39.02
N$11  (via drill 0.35)
  Top 0.2: U3.11 35.79,43.96 v35.8,43.97 | 48.82,42.73 45.65,42.73 44.31,41.39 v43.7,41.39
  Top 0.203: 48.82,42.73 49.89,43.79 63.81,43.79 R6.1 66.76,48.31 v66.76,48.9 | v67.1,52.98 67.12,53 U4.2
  Bottom 0.2: v35.8,43.97 41.12,43.97 v43.7,41.39
  Bottom 0.203: v66.76,48.9 66.76,52.64 v67.1,52.98
N$12  (via drill 0.35)
  Top 0.2: U3.10 35.4,44.46 35.54,44.6 36.32,44.6 v36.39,44.67 | 49.71,44.26 48.67,43.23 44.76,43.23 v44,42.47
  Top 0.203: 49.71,44.26 61.86,44.26 R7.1 63.86,48.78 v63.64,48.78 | v65.19,53.13 65.84,53.79 U4.1
  Bottom 0.2: v36.39,44.67 36.46,44.6 41.87,44.6 v44,42.47
  Bottom 0.203: v63.64,48.78 63.64,52.88 63.89,53.13 v65.19,53.13
N$14  (via drill 0.45)
  Top 0.2: U$2.13 U$2.14 56.23,79.43 57.77,80.96 69.15,80.96 70.94,79.17 C8.2
  Top 0.254: C8.2 73.77,78.53 v73.85,78.45 | U$3.3 78.86,74.97 78.86,74.98 78.86,74.99 v78.86,78.45
  Bottom 0.254: v73.85,78.45 v78.86,78.45 80.86,76.45 U$3.1
N$15
  Bottom 0.508: 11.62,36.98 11.62,35.46 11.59,35.43 11.22,35.8 11.22,36.29
N$16  (via drill 0.35)
  Top 0.2: U6.3 49.61,55.29 v49.44,55.11 | v55.65,55.12 v55.66,55.13 U5.3 | v61.89,55.11 61.89,57.04 U1.3 | v68.39,55.09 U4.3 | v73.31,55.08 74.14,55.08 74.84,55.79 VOTAGE_AND_CURENT_SENSOR.3 | 44.42,48.56 44.42,46.88 43.48,45.94 42.46,45.94 U3.30
  Top 0.203: 44.42,48.56 45.06,49.2 45.14,49.28 45.86,50 45.86,58.64 46.68,59.46 48.29,59.46 48.91,58.84 48.91,58.85 49.61,58.15 U6.3
  Bottom 0.2: v49.44,55.11 55.64,55.11 v55.65,55.12 v61.88,55.12 v61.89,55.11 68.37,55.11 v68.39,55.09 v73.3,55.09 v73.31,55.08
N$18  (via drill 0.35)
  Top 0.2: v71.17,58.41 73.23,58.41 73.58,58.07 VOTAGE_AND_CURENT_SENSOR.2
  Top 0.203: v72.53,41.78 72.53,38.63 v71.75,37.85 | v47.98,35.24 45.53,32.79 39.07,32.79 38.49,33.38 R15.1
  Bottom 0.2: v71.17,58.41
  Bottom 0.203: v71.17,58.41 74.27,58.41 75.37,57.32 75.37,55.85 73.8,54.28 70.44,54.28 69.74,53.58 69.74,51.09 70.05,50.78 71.31,50.78 73.78,53.25 79.04,53.25 79.94,52.35 79.94,44.23 78.77,43.06 73.81,43.06 v72.53,41.78 | v71.75,37.85 50.59,37.85 v47.98,35.24
N$19  (via drill 0.35)
  other vias: 67.23,68.47
N$20  (via drill 0.35)
  Top 0.152: C12.1 29.22,48.46 Y2.1 | Y2.1 30.21,49.44 | Y2.1 29.7,50.04 30.12,50.46 v30.12,51.49 v30.11,51.49 | v32.6,50.81 32.6,49.07 33.21,48.46 U3.2
  Bottom 0.152: v30.11,51.49 30.99,51.49 31.83,52.33 32.33,52.33 32.73,51.93 32.73,51.52 32.6,51.39 v32.6,50.81
N$21
  Top 0.203: U$1.12 56.91,84.32 57.42,84.83 57.42,85.47 58.13,86.18 66.06,86.18 67.4,84.84 C2.1
N$22
  Top 0.203: U$1.10 57.81,83.52 58.3,84.01 58.3,85.14 58.58,85.42 62.82,85.42 63.31,84.93 C3.1
N$23  (via drill 0.45)
  Top 0.203: U$1.8 U$1.9 58.17,83.12 C5.1 61.36,84.36 v61.38,84.34
  Bottom 0.203: v61.38,84.34 74.18,84.34 80.39,78.13 83.01,78.13 83.76,77.38 | 84.22,73.88 84.97,73.88 U$3.28
  Bottom 0.254: U$3.30 83.76,70.07 83.76,73.48 | 83.76,73.48 83.76,73.88 | 83.76,73.88 83.76,74.34 | 83.76,74.34 83.76,77.38 | U$3.28 84.19,73.91 83.76,73.48 | 84.22,73.88 84.13,73.97 | 84.13,73.97 84.01,74.09 | 84.01,74.09 83.76,74.34 | 84.13,73.97 84.04,73.88 83.91,73.88 | 83.91,73.88 83.76,73.88 | 84.01,74.09 83.91,73.99 83.91,73.88
N$24  (via drill 0.35)
  Top 0.152: C10.2 27.27,38.44 Y1.2
  Top 0.203: Y1.2 27.29,36.59 26.88,36.19 25.28,36.19 24.95,36.52 24.95,45.18 v25.44,45.67 | v31.73,45.96 32.23,46.46 U3.6
  Bottom 0.203: v25.44,45.67 25.88,46.11 31.73,46.11 v31.73,45.96
N$25
  Top 0.2: U$2.12 56.96,78.26 57.22,78.52 57.22,79.7 58.09,80.57 66.09,80.57 67.42,79.24 C6.1
N$26
  Top 0.2: U$2.10 57.37,77.46 58.34,78.43 58.34,79.28 58.71,79.65 62.59,79.65 63.31,78.93 C7.1
N$27  (via drill 0.35)
  Top 0.152: C1.2 29.17,38.44 Y1.1
  Top 0.203: Y1.1 29.19,36.18 28.6,35.59 24.78,35.59 24.36,36.01 24.36,46.5 v25.4,47.53 | v31.7,47.58 32.32,46.96 U3.5
  Bottom 0.203: v25.4,47.53 31.65,47.53 v31.7,47.58
N$28  (via drill 0.45)
  Top 0.2: U$2.9 57.95,77.06 C9.1
  Top 0.203: U$2.9 U$2.8
  Top 0.254: v61.47,77.6 60.52,78.55 C9.1
  Bottom 0.254: U$3.2 78.77,77.6 v61.47,77.6 64.09,74.98 76.31,74.98 U$3.4
N$29  (via drill 0.35)
  Top 0.152: C11.1 27.31,48.83 Y2.2 v29.02,50.75 | v32.08,51.72 31.99,51.64 31.99,48.74 33.28,47.45 34.07,47.45 U3.4
  Bottom 0.152: v29.02,50.75 31.22,50.75 32.06,51.6 32.06,51.71 v32.08,51.72
N$30
  Top 0.61: D8.C 24.51,82.86 25.8,81.57 25.8,73.47 26.5,72.77 28.07,72.77
  Top 0.85: IC2.2 28.07,72.77 39.08,72.77 L3.1
N$31  (1 unrouted)
  Top 0.813: DP2.A 76.36,25.21 76.66,25.51 76.76,25.51 78.46,23.81 78.46,11.35 73.46,6.35 70.02,6.35
N$32  (1 unrouted)
  Top 0.813: DP3.A 76.82,32.81 77.26,32.81 79.86,30.21 79.86,4.73 76.62,1.49 | J3.2 61.89,4.72 61.89,2.21 62.62,1.48 76.68,1.48
N$33
  Top 0.152: 66.07,11.76 66.15,11.85 | 60.66,11.85 60.57,11.76
  Top 0.813: DP4.A 76.07,40.61 74.76,40.61 73.85,39.7 73.85,16.45 69.24,11.85 66.15,11.85 60.66,11.85 | 60.57,11.76 57.02,8.2 57.02,6.43 J4.2
N$34
  Top 0.813: DP1.A 76.36,12.27 72.06,7.98 67.57,7.98 66.98,7.38 66.98,4.12 68.59,2.51 71.9,2.51 75.82,6.42 J1.2
N$36
  Top 0.406: 42.93,22.96 D1.A 43.44,22.56 43.47,22.56 43.71,22.8 49.34,22.8 51.77,20.37 L1.2 50.21,18.58
  Top 0.61: IC1.4 58.36,21.33 55.6,18.57 L1.2
N$37
  Top 0.508: IC1.2 54.96,29.08 54.23,29.81 52.26,29.81 51.7,29.25 51.7,28.07 49.6,25.97 39.76,25.97 38.57,24.78 38.57,23.03 D1.C 38.51,23.01 38.51,23.18
  Top 0.61: D2.A 38.59,18.85 D1.C 35.95,23.01 C3..+
N$38
  Top 0.61: IC1.1 53.26,27.13 50.27,24.14 R1..2
N$39
  Top 0.152: U1.1 59.36,50.87 R13.2
N$40
  Top 0.61: R1..1 47.97,18.86 C2..1
N$41  (via drill 0.35, 0.6)
  Top 0.254: U2.1 11.55,12.52 11.72,12.69 12.53,12.69 12.85,12.37 U2.3 12.85,10.62 v12,9.77 | v45.61,17.71 R.2.2
  Top 0.406: v2.7,38.47 4.11,39.88 D7.C | C4..1 44.9,15.54 45.14,15.3 45.4,15.3 R.2.2
  Top 0.61: D2.C 42.97,15.61 C4..1 | IC2.1 30.78,71.1 31.55,70.33 v31.55,70.3
  Top 0.813: D7.C 4.11,44.18 4.6,44.67 5.54,44.67 C8..+ C7..+ | C7..+ 11.27,44.55 11.4,44.67 11.04,44.67 C7..+ | IC3.1 27.6,55.62 v27.6,52.62 27.6,52.11 24.1,48.6 14.97,48.6 C7..+
  Bottom 0.254: v12,9.77 12,7.57 13.48,6.09 | 13.48,6.09 13.5,6.07 | 13.48,6.09 26.88,6.09 30.14,2.83 49.67,2.83 51.03,4.2 51.03,15.92 49.23,17.71 v45.61,17.71
  Bottom 0.406: v12,9.77 11.1,10.67 3,10.67 1.3,12.37 1.3,37.07 v2.7,38.47
  Bottom 0.61: v31.55,70.3 31.55,56.57 v27.6,52.62
N$42  (via drill 0.35)
  Top 0.254: U2.2 12.2,10.97 10.8,9.57 v10.1,9.57 | v47.78,12.75 45.65,12.75 R.2.1
  Top 0.406: R.3.2 45.39,12.93 R.2.1
  Top 0.61: R.3.2 43.02,12.31
  Bottom 0.254: v10.1,9.57 10.1,8.27 12.9,5.47 26.3,5.47 29.88,1.89 49.58,1.89 51.84,4.16 51.84,15.96 49.4,18.41 44.78,18.41 44.34,17.96 44.34,13.34 44.92,12.75 v47.78,12.75
N$43
  Top 0.406: D3.C 7.38,11.76 R.1.1
N$44
  Top 0.254: R.1.2 12.31,8.88 13.5,10.07 U2.4
N$46
  Top 0.305: D5.C 12.2,17.66 U2.11
  Top 0.508: C5..2 D5.C
N$47
  Top 0.254: C5..1 4.19,17.35 5.49,16.05 11.52,16.05 U2.12
  Top 0.305: D4.A 4.13,22.99 4.13,19.21 C5..1
  Top 0.406: L2.1 10.89,26.59 7.64,23.33 3.42,23.33 3.76,22.99 4.13,22.99
N$48
  Top 0.305: U2.10 12.85,24.32 21,32.47 21.45,32.02 21.4,31.97 | 21.4,31.97 21.24,31.81 L2.2 | 21.54,31.83 21.4,31.97
  Top 0.406: R.8.2 21.59,31.78 21.54,31.83
N$49
  Top 0.254: R.6.1 15.66,14.21 14.8,15.07 U2.7
N$50
  Top 0.508: D5.A 17.64,19.15 D6.A
N$51  (via drill 0.35)
  Top 0.152: VBAT.1 25.1,4.11
  Top 0.2: 71.77,64.34 71.8,64.31 72.23,63.88 72.99,63.88 73.58,63.3 VOTAGE_AND_CURENT_SENSOR.7
  Top 0.203: v71.78,65.09 71.78,64.33 71.8,64.31
  Top 0.254: R.9.1 16.98,16.5 15.99,17.48 14.01,17.48 13.5,16.97 U2.9
  Top 0.305: C.6.+ 17.47,9.45 | 17.47,9.45 21.1,13.08 21.1,15.02 R.9.1 18.69,17.43 D6.C | 18.69,23.71 R.8.1 | 18.41,9.14 18.1,9.45 17.47,9.45 | v46.39,40.74 R12.1
  Top 0.406: D6.C 18.69,23.71 | R.8.1 v18.79,26.16 v18.8,26.17
  Top 0.508: v10.8,36.17 4.17,36.17 D7.A
  Top 0.813: 18.37,8.01 17.57,8.81 | 17.57,8.81 C.6.+ | 17.57,8.81 20.4,8.81 22.78,6.42 | 25.1,4.11 22.78,6.42 | VBAT1.2 25.18,8.82 22.78,6.42
  Bottom 0.305: v46.39,40.74 47.57,39.56 82.91,39.56 83.85,40.5 83.85,64.09 82.85,65.09 v71.78,65.09
  Bottom 0.508: v18.8,26.17 18.8,28.17 v10.8,36.17 21.38,46.75 41.51,46.75 46.39,41.87 v46.39,40.74
N$52  (via drill 0.35)
  Top 0.254: U2.8 14.15,16.82 14.4,17.07 15.5,17.07 16.7,15.87 v16.7,15.27
  Bottom 0.305: v16.7,15.27 29.18,15.27 30.52,16.61 30.52,18.22 NTC1.1
N$54
  Top 0.508: R.10.1 22.59,16.66 R.9.2 22.43,14.25 R.6.2
N$55  (via drill 0.35, 0.6)  (3 unrouted)
  Top 0.152: C1.1.+ 68.4,69.66 67.22,68.48 | U3.24 41.01,46.66 39.51,48.16 39.51,48.7 | 39.51,48.7 39.51,48.94 39.53,48.96 | 39.51,48.7 39.25,48.96 | 39.51,48.7 39.77,48.96 39.79,48.96
  Top 0.2: U3.9 35.14,44.96 35.52,45.34 35.52,48.75 | 35.52,48.75 35.52,48.94 | 35.52,48.94 35.52,49.92 35.51,49.93 | 35.77,48.94 35.57,48.75 35.52,48.75 | 35.78,48.96 35.77,48.94 | 35.77,48.94 35.52,48.94
  Top 0.203: U6.5 v50.88,59.71 v50.89,59.7 | v56.91,59.7 56.91,61.97 U5.5 | v63.18,59.67 63.18,61.37 63.07,61.48 63.07,61.89 U1.5 | v69.64,63.97 69.64,62.05 U4.5 | v76.12,63.93 VOTAGE_AND_CURENT_SENSOR.5 | 51.83,76.66 52.12,76.66 | 51.83,76.66 49.61,76.66 49.59,76.64 | U$2.6 U$2.7 55.67,75.3 55.67,73.66 | U$2.2 U$2.1 52.73,79.06 52.1,78.43 52.1,76.93 | 52.1,76.93 52.1,76.68 52.12,76.66 | 52.1,76.93 51.83,76.66 | C1.3.+ 55.67,73.66 | U3.36 39.79,48.96 39.53,48.96 39.25,48.96 35.78,48.96 35.51,49.23 35.51,49.93 U3.48 | C14.2 39.22,39.57 40.84,39.57 C13.2 41.01,39.67 U3.24 | 52.12,76.66 52.12,75.82 54.28,73.66 55.67,73.66
  Top 0.254: 40.38,78.87 41.5,78.87 | C1.4.+ 48.17,72.63 44.5,68.95 44.5,53.68 43.59,52.78 36.24,52.78 35.51,52.05 U3.48
  Top 0.305: v43.94,39.5 43.87,39.57 40.84,39.57
  Top 0.406: U1.5 63.17,62.67 v64.47,63.96 65.12,64.61 65.12,71.67 | 64.16,72.63 65.12,71.67 | 65.12,71.67 66,72.55 66,72.63 | 65.12,72.63 65.12,71.67
  Top 0.813: IC2.4 31.43,76.2 34.11,78.88 37.8,78.88 | 37.8,78.88 v39.09,78.88 | 37.8,78.88 39.09,80.17 | 39.09,80.27 39.09,80.17 | v39.1,78.87 40.38,78.87 | 40.38,78.87 47.36,78.87 49.59,76.64 49.59,72.66 49.22,72.29 49.27,72.29 C1.4.+ | 39.09,80.17 39.09,80.16 40.38,78.87
  Top 0.85: C9..+ v8.49,78.86 v8.5,78.87 | v39.1,78.87 v39.09,78.88 39.09,80.27 L3.2
  Top 1.016: C1.4.+ 64.16,72.63 65.12,72.63 66,72.63 74.86,72.63 C1.5.+
  Bottom 0.152: v64.47,63.96 67.2,66.69 67.2,68.47
  Bottom 0.203: v50.89,59.7 v56.91,59.7 63.15,59.7 v63.18,59.67 | v64.47,63.96 v69.63,63.96 v69.64,63.97 76.08,63.97 v76.12,63.93
  Bottom 0.305: ST-LINK.1 42.66,8.13 42.66,31.36 44.76,33.46 44.76,38.68 v43.94,39.5
  Bottom 0.85: v8.5,78.87 v39.1,78.87
N$56
  Top 0.508: D9.C 24.48,51.25 25.9,52.67 25.9,56.77 26.9,57.77 28.03,57.77 IC3.2
  Top 0.85: IC3.2 38.51,57.76 38.6,57.67 39.03,57.67 L4.1
N$58  (via drill 0.35)
  Top 0.203: U6.7 v48.34,60.34 v48.34,60.33 | v54.36,60.37 54.36,61.96 U5.7 | v60.65,60.37 60.65,61.98 U1.7 | v67.13,60.36 67.13,62.02 U4.7 | 72.77,52.6 R5.1
  Top 0.254: v70.67,52.6 72.77,52.6
  Top 0.406: 64.96,31.21 64.83,31.08 C2.1.1 | IC1.5 60.08,27.71
  Top 0.61: 60.24,20.06 L1.1 | 64.77,31.21 64.96,31.21 | R11.1 R9.1 72.69,47.54 72.71,47.56 R8.1 72.81,50.09 R5.1
  Top 0.813: 60.24,20.06 60.24,27.52 IC1.5 63.05,30.68 C2.1.1 | C2.1.1 64.15,30.68 | 68.96,39.18 68.96,41.21 R11.1 72.81,45.06 R5.1 | C2.1.1 67.29,30.68 DP3.C | DP3.C DP2.C 68.96,15.81 | DP4.C 68.96,33.04 68.93,33.01 68.93,32.38 DP3.C
  Top 1.27: DP4.C 68.96,39.18 | 68.96,15.81 DP1.C
  Bottom 0.203: v48.34,60.33 54.32,60.33 v54.36,60.37 v60.65,60.37 v67.12,60.37 v67.13,60.36 | 70.69,52.62 v70.67,52.6
  Bottom 0.254: v67.13,60.36 67.78,59.71 76.51,59.71 77.16,59.06 77.16,56.78 74.05,53.66 73.23,53.66 72.19,52.62 | 72.19,52.62 72.17,52.59 | 72.19,52.62 70.69,52.62
NTC  (via drill 0.35)  (1 unrouted)
  Top 0.2: v28.08,17.96 30.19,20.08 30.19,33.36 37.53,40.7 37.53,42.02 U3.17
  Top 0.203: v70.98,57.12 VOTAGE_AND_CURENT_SENSOR.1 | v37.83,47.62 37.51,47.3 U3.17
  Top 0.508: R.4.1 28.51,17.53 v28.08,17.96
  Bottom 0.203: v70.98,57.12 47.68,57.12 45.8,55.24 45.08,55.24 44,54.16 41.2,54.16 37.83,50.79 v37.83,47.62
  Bottom 0.305: NTC1.2 27.81,20.75
  Bottom 0.508: NTC1.2 27.81,18.12 28.07,17.9 28.08,17.9 v28.08,17.96
PA5  (via drill 0.35)
  Top 0.2: v49.6,84.34 54.22,84.34 U$1.3
  Top 0.203: v19.14,46.18 21.38,43.95 23.14,43.95 23.79,43.3 23.79,35.84 24.61,35.02 31.26,35.02 36.51,40.27 U3.15
  Bottom 0.2: 38.38,54.77 38.38,73.12 v49.6,84.34
  Bottom 0.203: 38.38,54.77 32.29,48.68 21.63,48.68 v19.14,46.18
PA6  (via drill 0.35)
  Top 0.2: v50.27,83.5 50.29,83.52 U$1.5
  Top 0.203: v37.02,48.27 37.02,42.04 U3.16
  Bottom 0.2: 38.09,53.34 39.13,54.38 39.13,72.36 v50.27,83.5
  Bottom 0.203: 38.09,53.34 37.02,52.27 v37.02,48.27
PB0  (via drill 0.35)
  Top 0.2: U$2.5 54.27,77.43 53.82,77.43 53.08,76.69 v52.92,76.69 | v17.08,46.37 17.08,44.58 18.36,43.3 22.67,43.3 23.35,42.62 23.35,36.83 23.35,35.44 24.5,34.29 v28.51,34.29 | v32.46,34.5 32.46,34.97 37.37,39.88 37.37,39.87 38.01,40.5 U3.18
  Bottom 0.2: v52.92,76.69 55.1,78.87 55.1,84.63 54.03,85.7 47.86,85.7 37.86,75.69 37.86,61.01 27.6,50.75 21.46,50.75 v17.08,46.37 | v28.51,34.29 32.25,34.29 v32.46,34.5
PB1  (via drill 0.35)
  Top 0.203: v52.85,77.82 53.29,78.26 U$2.3 | 43.39,53.88 43,53.49 v41.79,53.49 | v38.52,48.26 v38.51,48.26 U3.19 | 43.99,73.94 v44.81,74.76
  Top 0.254: 43.39,53.88 43.99,54.48 43.99,73.94
  Bottom 0.203: v44.81,74.76 44.82,74.75 47.88,77.81 52.83,77.81 v52.85,77.82 | v41.79,53.49 38.52,50.23 v38.52,48.26
VIN+INA19
  Top 0.203: U$1.13 U$1.14 | U$1.14 57.61,86.56 69.28,86.56 70.99,84.85 C4.2 74.16,84.34 80.37,78.13 84.1,78.13 85,77.23 U$3.27 | U$3.29 86.2,72.57 86.2,77.36 84.7,78.86 80.47,78.86 72.16,87.17 57.46,87.17 56.17,85.89 U$1.14
(copper drawn outside any net)
  shapes: Top area x10